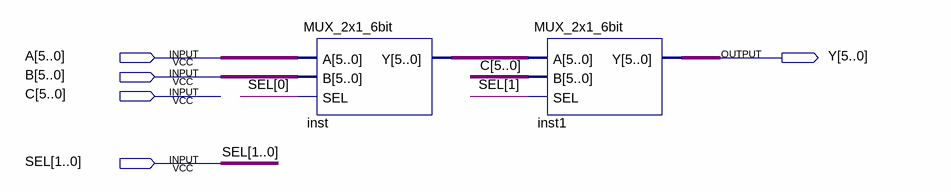
[diagram p0: schematic sheet]
// Quartus schematic MUX_3x1_6bit.bdf as structural Verilog: 2 symbols, 5 pins
module MUX_3x1_6bit (
  input  [5:0] A,
  input  [5:0] B,
  input  [5:0] C,
  input  [1:0] SEL,
  output [5:0] Y
);

  wire [5:0] inst_y;

  MUX_2x1_6bit inst (.A(A), .B(B), .SEL(SEL[0]), .Y(inst_y));
  MUX_2x1_6bit inst1 (.A(inst_y), .B(C), .SEL(SEL[1]), .Y(Y));
endmodule
